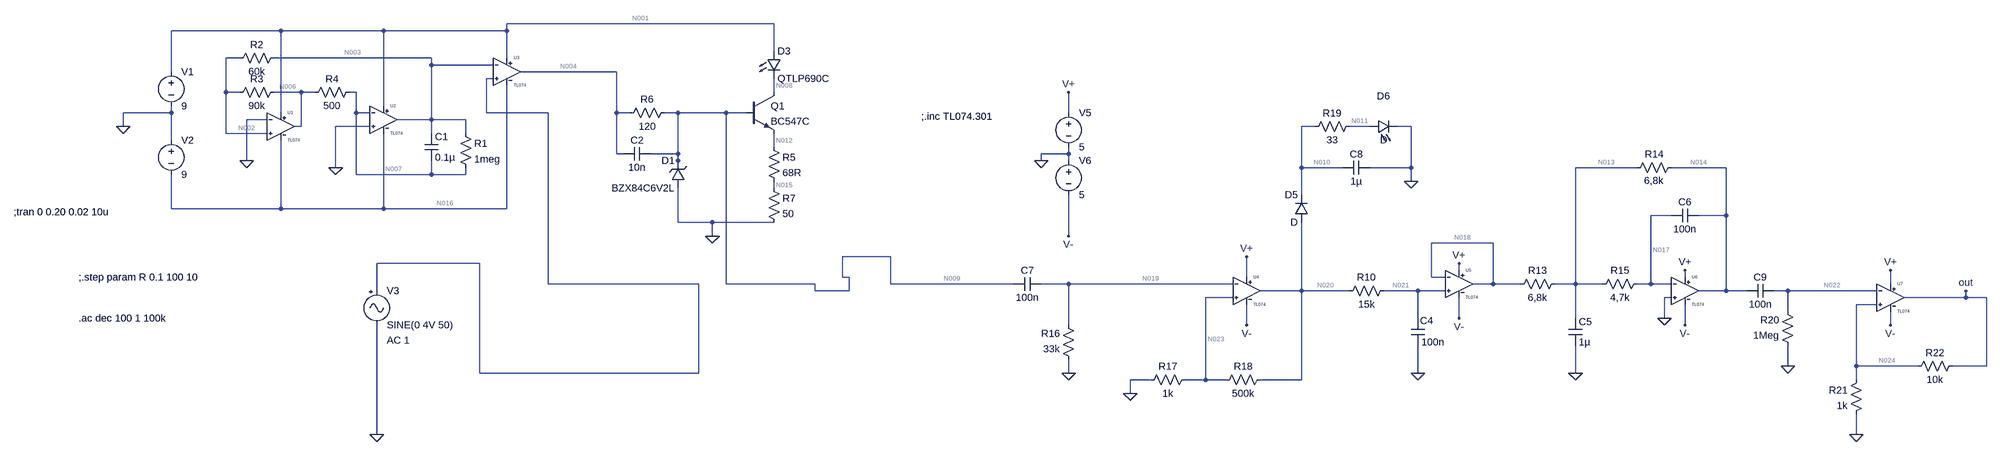
[diagram p0: schematic simTotal.asc]
simTotal.asc, the LTspice schematic file:
Version 4
SHEET 1 4244 964
WIRE 1408 -16 784 -16
WIRE 256 0 0 0
WIRE 496 0 256 0
WIRE 784 0 784 -16
WIRE 784 0 496 0
WIRE 1408 48 1408 -16
WIRE 160 64 128 64
WIRE 608 64 240 64
WIRE 784 64 784 0
WIRE 608 80 608 64
WIRE 752 80 608 80
WIRE 0 96 0 0
WIRE 1040 96 816 96
WIRE 752 112 736 112
WIRE 128 144 128 64
WIRE 160 144 128 144
WIRE 304 144 240 144
WIRE 336 144 304 144
WIRE 432 144 416 144
WIRE 1408 144 1408 112
WIRE 496 176 496 0
WIRE 0 192 0 176
WIRE 0 192 -112 192
WIRE 256 192 256 0
WIRE 432 192 432 144
WIRE 464 192 432 192
WIRE 736 192 736 112
WIRE 880 192 736 192
WIRE 1040 192 1040 96
WIRE 1072 192 1040 192
WIRE 1184 192 1152 192
WIRE 1296 192 1184 192
WIRE 1344 192 1296 192
WIRE 2096 192 2096 144
WIRE 224 208 176 208
WIRE 608 208 608 80
WIRE 608 208 528 208
WIRE 688 208 608 208
WIRE -112 224 -112 192
WIRE 304 224 304 144
WIRE 304 224 288 224
WIRE 464 224 384 224
WIRE 2672 224 2640 224
WIRE 2800 224 2752 224
WIRE 2896 224 2864 224
WIRE 128 240 128 144
WIRE 224 240 128 240
WIRE 608 240 608 208
WIRE 688 240 688 208
WIRE 0 256 0 192
WIRE 1408 272 1408 240
WIRE 1040 288 1040 192
WIRE 1056 288 1040 288
WIRE 1184 288 1184 192
WIRE 1184 288 1120 288
WIRE 2096 288 2096 272
WIRE 2096 288 2032 288
WIRE 176 304 176 208
WIRE 1184 304 1184 288
WIRE 2032 304 2032 288
WIRE 2096 304 2096 288
WIRE 384 320 384 224
WIRE 1184 320 1184 304
WIRE 2640 320 2640 224
WIRE 2736 320 2640 320
WIRE 2896 320 2896 224
WIRE 2896 320 2800 320
WIRE 3424 320 3280 320
WIRE 3632 320 3504 320
WIRE 432 336 432 192
WIRE 608 336 608 304
WIRE 608 336 432 336
WIRE 688 336 688 320
WIRE 688 336 608 336
WIRE 2896 352 2896 320
WIRE 1408 368 1408 352
WIRE 2640 384 2640 320
WIRE 0 416 0 336
WIRE 256 416 256 256
WIRE 256 416 0 416
WIRE 496 416 496 240
WIRE 496 416 256 416
WIRE 784 416 784 128
WIRE 784 416 496 416
WIRE 3504 432 3456 432
WIRE 3632 432 3632 320
WIRE 3632 432 3568 432
WIRE 1184 448 1184 368
WIRE 1264 448 1184 448
WIRE 1408 448 1264 448
WIRE 1264 480 1264 448
WIRE 2096 480 2096 384
WIRE 3088 496 2944 496
WIRE 1680 528 1568 528
WIRE 720 544 480 544
WIRE 3008 560 3008 544
WIRE 1568 576 1568 528
WIRE 1584 576 1568 576
WIRE 2512 576 2512 528
WIRE 2944 576 2944 496
WIRE 2976 576 2944 576
WIRE 3536 576 3536 560
WIRE 880 592 880 192
WIRE 1232 592 880 592
WIRE 1296 592 1296 192
WIRE 1504 592 1296 592
WIRE 1680 592 1680 528
WIRE 1968 592 1680 592
WIRE 2096 592 2032 592
WIRE 2480 592 2096 592
WIRE 3088 592 3088 496
WIRE 3088 592 3040 592
WIRE 3152 592 3088 592
WIRE 3280 592 3280 320
WIRE 3280 592 3232 592
WIRE 3344 592 3280 592
WIRE 3456 592 3456 432
WIRE 3456 592 3424 592
WIRE 3504 592 3456 592
WIRE 4016 592 4016 560
WIRE 480 608 480 544
WIRE 1504 608 1504 592
WIRE 1584 608 1584 576
WIRE 1584 608 1504 608
WIRE 2640 608 2640 448
WIRE 2640 608 2544 608
WIRE 2752 608 2640 608
WIRE 2912 608 2832 608
WIRE 2976 608 2912 608
WIRE 3632 608 3632 432
WIRE 3632 608 3568 608
WIRE 3680 608 3632 608
WIRE 3776 608 3744 608
WIRE 3984 608 3776 608
WIRE 2480 624 2416 624
WIRE 3504 624 3488 624
WIRE 4192 624 4192 608
WIRE 4192 624 4048 624
WIRE 4240 624 4192 624
WIRE 3984 640 3936 640
WIRE 3776 656 3776 608
WIRE 2912 672 2912 608
WIRE 3008 672 3008 624
WIRE 3280 672 3280 592
WIRE 3488 672 3488 624
WIRE 2096 688 2096 592
WIRE 2512 688 2512 640
WIRE 3536 688 3536 640
WIRE 4016 688 4016 656
WIRE 3776 784 3776 736
WIRE 3936 784 3936 640
WIRE 4080 784 3936 784
WIRE 4240 784 4240 624
WIRE 4240 784 4160 784
WIRE 720 800 720 544
WIRE 1232 800 1232 592
WIRE 1232 800 720 800
WIRE 2096 800 2096 768
WIRE 2912 800 2912 736
WIRE 3280 800 3280 736
WIRE 2288 816 2240 816
WIRE 2416 816 2416 624
WIRE 2416 816 2368 816
WIRE 2464 816 2416 816
WIRE 2640 816 2640 608
WIRE 2640 816 2544 816
WIRE 3936 816 3936 784
WIRE 2240 848 2240 816
WIRE 480 944 480 688
WIRE 3936 944 3936 896
FLAG -112 224 0
FLAG 176 304 0
FLAG 384 320 0
FLAG 1264 480 0
FLAG 480 944 0
FLAG 2912 800 0
FLAG 3280 800 0
FLAG 3488 672 0
FLAG 2096 144 V+
FLAG 3008 544 V+
FLAG 3536 560 V+
FLAG 3536 688 V-
FLAG 3008 672 V-
FLAG 2096 480 V-
FLAG 2032 304 0
FLAG 2512 528 V+
FLAG 2512 688 V-
FLAG 2096 800 0
FLAG 2240 848 0
FLAG 2896 352 0
FLAG 3776 784 0
FLAG 4016 560 V+
FLAG 4016 688 V-
FLAG 3936 944 0
FLAG 4192 608 out
SYMBOL voltage 0 80 R0
WINDOW 123 0 0 Left 2
WINDOW 39 0 0 Left 2
SYMATTR InstName V1
SYMATTR Value 9
SYMBOL voltage 0 240 R0
WINDOW 123 0 0 Left 2
WINDOW 39 0 0 Left 2
SYMATTR InstName V2
SYMATTR Value 9
SYMBOL cap 592 240 R0
SYMATTR InstName C1
SYMATTR Value 0.1µ
SYMBOL res 672 224 R0
SYMATTR InstName R1
SYMATTR Value 1meg
SYMBOL res 256 48 R90
WINDOW 0 0 56 VBottom 2
WINDOW 3 32 56 VTop 2
SYMATTR InstName R2
SYMATTR Value 60k
SYMBOL res 256 128 R90
WINDOW 0 0 56 VBottom 2
WINDOW 3 32 56 VTop 2
SYMATTR InstName R3
SYMATTR Value 90k
SYMBOL res 432 128 R90
WINDOW 0 0 56 VBottom 2
WINDOW 3 32 56 VTop 2
SYMATTR InstName R4
SYMATTR Value 500
SYMBOL Misc\\signal 480 592 R0
WINDOW 123 24 132 Left 2
WINDOW 39 0 0 Left 2
SYMATTR Value2 AC 1
SYMATTR InstName V3
SYMATTR Value SINE(0 4V 50)
SYMBOL npn 1344 144 R0
SYMATTR InstName Q1
SYMATTR Value BC547C
SYMBOL res 1168 176 R90
WINDOW 0 0 56 VBottom 2
WINDOW 3 32 56 VTop 2
SYMATTR InstName R6
SYMATTR Value 120
SYMBOL res 1392 352 R0
SYMATTR InstName R7
SYMATTR Value 50
SYMBOL zener 1200 368 R180
WINDOW 0 24 64 Left 2
WINDOW 3 24 0 Left 2
SYMATTR InstName D1
SYMATTR Value BZX84C6V2L
SYMBOL cap 1120 272 R90
WINDOW 0 0 32 VBottom 2
WINDOW 3 32 32 VTop 2
SYMATTR InstName C2
SYMATTR Value 10n
SYMBOL TL074 256 160 R0
SYMATTR InstName U1
SYMBOL TL074 496 144 R0
SYMATTR InstName U2
SYMBOL TL074 784 32 R0
SYMATTR InstName U3
SYMBOL LED 1392 48 R0
SYMATTR InstName D3
SYMATTR Value QTLP690C
SYMBOL res 1392 256 R0
SYMATTR InstName R5
SYMATTR Value 68R
SYMBOL cap 2896 672 R0
WINDOW 0 21 6 Left 2
SYMATTR InstName C4
SYMATTR Value 100n
SYMBOL cap 3264 672 R0
SYMATTR InstName C5
SYMATTR Value 1µ
SYMBOL cap 3568 416 R90
WINDOW 0 0 32 VBottom 2
WINDOW 3 32 32 VTop 2
SYMATTR InstName C6
SYMATTR Value 100n
SYMBOL res 2848 592 R90
WINDOW 0 0 56 VBottom 2
WINDOW 3 32 56 VTop 2
SYMATTR InstName R10
SYMATTR Value 15k
SYMBOL res 3248 576 R90
WINDOW 0 0 56 VBottom 2
WINDOW 3 32 56 VTop 2
SYMATTR InstName R13
SYMATTR Value 6,8k
SYMBOL res 3520 304 R90
WINDOW 0 0 56 VBottom 2
WINDOW 3 31 57 VTop 2
SYMATTR InstName R14
SYMATTR Value 6,8k
SYMBOL res 3440 576 R90
WINDOW 0 0 56 VBottom 2
WINDOW 3 32 56 VTop 2
SYMATTR InstName R15
SYMATTR Value 4,7k
SYMBOL voltage 2096 176 R0
WINDOW 123 0 0 Left 2
WINDOW 39 0 0 Left 2
SYMATTR InstName V5
SYMATTR Value 5
SYMBOL voltage 2096 288 R0
WINDOW 123 0 0 Left 2
WINDOW 39 0 0 Left 2
SYMATTR InstName V6
SYMATTR Value 5
SYMBOL res 2112 784 R180
WINDOW 0 36 76 Left 2
WINDOW 3 36 40 Left 2
SYMATTR InstName R16
SYMATTR Value 33k
SYMBOL cap 2032 576 R90
WINDOW 0 0 32 VBottom 2
WINDOW 3 32 32 VTop 2
SYMATTR InstName C7
SYMATTR Value 100n
SYMBOL res 2384 800 R90
WINDOW 0 0 56 VBottom 2
WINDOW 3 32 56 VTop 2
SYMATTR InstName R17
SYMATTR Value 1k
SYMBOL res 2560 800 R90
WINDOW 0 0 56 VBottom 2
WINDOW 3 32 56 VTop 2
SYMATTR InstName R18
SYMATTR Value 500k
SYMBOL diode 2656 448 R180
WINDOW 0 24 64 Left 2
WINDOW 3 24 0 Left 2
SYMATTR InstName D5
SYMBOL LED 2800 240 R270
WINDOW 0 72 32 VTop 2
WINDOW 3 0 32 VBottom 2
SYMATTR InstName D6
SYMBOL res 2768 208 R90
WINDOW 0 0 56 VBottom 2
WINDOW 3 32 56 VTop 2
SYMATTR InstName R19
SYMATTR Value 33
SYMBOL cap 2800 304 R90
WINDOW 0 0 32 VBottom 2
WINDOW 3 32 32 VTop 2
SYMATTR InstName C8
SYMATTR Value 1µ
SYMBOL cap 3744 592 R90
WINDOW 0 0 32 VBottom 2
WINDOW 3 32 32 VTop 2
SYMATTR InstName C9
SYMATTR Value 100n
SYMBOL res 3792 752 R180
WINDOW 0 36 76 Left 2
WINDOW 3 36 40 Left 2
SYMATTR InstName R20
SYMATTR Value 1Meg
SYMBOL res 3952 800 M0
SYMATTR InstName R21
SYMATTR Value 1k
SYMBOL res 4064 800 R270
WINDOW 0 32 56 VTop 2
WINDOW 3 0 56 VBottom 2
SYMATTR InstName R22
SYMATTR Value 10k
SYMBOL TL074 2512 544 R0
SYMATTR InstName U4
SYMBOL TL074 3008 528 R0
SYMATTR InstName U5
SYMBOL TL074 3536 544 R0
SYMATTR InstName U6
SYMBOL TL074 4016 560 R0
SYMATTR InstName U7
TEXT -368 424 Left 2 !;tran 0 0.20 0.02 10u
TEXT -216 576 Left 2 !;.step param R 0.1 100 10
TEXT 1752 200 Left 2 !;.inc TL074.301
TEXT -216 672 Left 2 !.ac dec 100 1 100k

The netlist it stands for:
* simTotal.asc
V1 N001 0 9
V2 0 N016 9
C1 N003 N007 0.1µ
R1 N003 N007 1meg
R2 N003 N002 60k
R3 N006 N002 90k
R4 N007 N006 500
V3 N005 0 SINE(0 4V 50) AC 1
Q1 N008 N009 N012 0 BC547C
R6 N009 N004 120
R7 N015 0 50
D1 0 N009 BZX84C6V2L
C2 N009 N004 10n
XU1 N002 0 N001 N016 N006 TL074  ; pins In+ In- V+ V- OUT
XU2 0 N007 N001 N016 N003 TL074  ; pins In+ In- V+ V- OUT
XU3 N005 N003 N001 N016 N004 TL074  ; pins In+ In- V+ V- OUT
D3 N001 N008 QTLP690C
R5 N012 N015 68R
C4 N021 0 100n
C5 N013 0 1µ
C6 N014 N017 100n
R10 N021 N020 15k
R13 N013 N018 6,8k
R14 N014 N013 6,8k
R15 N017 N013 4,7k
V5 V+ 0 5
V6 0 V- 5
R16 0 N019 33k
C7 N019 N009 100n
R17 N023 0 1k
R18 N020 N023 500k
D5 N020 N010 D
D6 N011 0 D
R19 N011 N010 33
C8 0 N010 1µ
C9 N022 N014 100n
R20 0 N022 1Meg
R21 N024 0 1k
R22 N024 out 10k
XU4 N023 N019 V+ V- N020 TL074  ; pins In+ In- V+ V- OUT
XU5 N021 N018 V+ V- N018 TL074  ; pins In+ In- V+ V- OUT
XU6 0 N017 V+ V- N014 TL074  ; pins In+ In- V+ V- OUT
XU7 N024 N022 V+ V- out TL074  ; pins In+ In- V+ V- OUT
.model D D
.lib standard.dio
.model NPN NPN
.model PNP PNP
.lib standard.bjt
;tran 0 0.20 0.02 10u
;.step param R 0.1 100 10
;.inc TL074.301
.ac dec 100 1 100k
.lib OWN.lib
.backanno
.end

* Results of the author's LTspice run, read from the files saved beside the schematic
* Operating Point, zero values left out:
*   V(n001) = 9 V
*   V(n016) = -9 V
*   V(n003) = -23.28 µV
*   V(n007) = 10.97 µV
*   V(n002) = -10.97 µV
*   V(n006) = 11.01 µV
*   V(n008) = 6.871 V
*   V(n009) = 6.3 V
*   V(n012) = 5.559 V
*   V(n004) = 6.744 V
*   V(n015) = 2.355 V
*   V(n021) = 2.321 V
*   V(n013) = 21.71 µV
*   V(n014) = -2.321 V
*   V(n017) = 21.47 µV
*   V(n020) = 2.321 V
*   V(n018) = 2.321 V
*   V(v+) = 5 V
*   V(v-) = -5 V
*   V(n019) = -1.157 µV
*   V(n023) = 4.632 mV
*   V(n010) = 1.582 V
*   V(n011) = 738.9 mV
*   V(n022) = -34.74 µV
*   V(n024) = 314.5 mV
*   V(out) = 3.459 V
*   Ic(Q1) = 46.97 mA
*   Ib(Q1) = 136.3 µA
*   Ie(Q1) = -47.11 mA
*   I(D6) = 25.55 mA
*   I(D5) = 25.55 mA
*   I(D3) = 46.97 mA
*   I(D1) = -3.563 mA
*   I(R22) = -314.5 µA
*   I(R21) = 314.5 µA
*   I(R20) = 34.74 pA
*   I(R19) = -25.55 mA
*   I(R18) = 4.633 µA
*   I(R17) = 4.632 µA
*   I(R16) = 35.05 pA
*   I(R15) = -35.05 pA
*   I(R14) = -290.1 µA
*   I(R13) = -290.1 µA
*   I(R10) = -37.38 pA
*   I(R5) = 47.11 mA
*   I(R7) = 47.11 mA
*   I(R6) = -3.7 mA
*   I(R4) = -73.3 pA
*   I(R3) = 244.2 pA
*   I(R2) = -205.2 pA
*   I(R1) = -34.25 pA
*   I(V6) = -19.44 mA
*   I(V5) = -19.35 mA
*   I(V3) = -39.05 pA
*   I(V2) = -25.78 mA
*   I(V1) = -72.75 mA
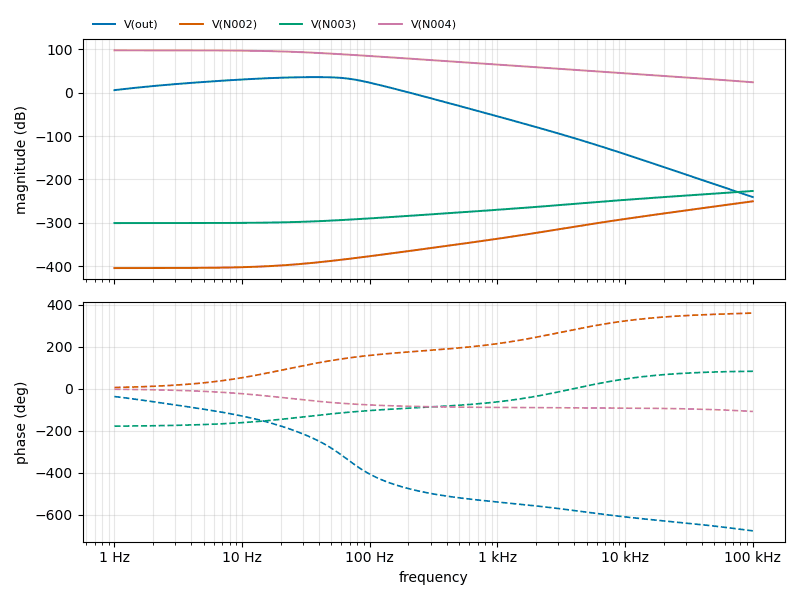
[diagram p1: AC Analysis of simTotal.asc, plotted from the saved traces]
* AC Analysis, 1 run:
*   V(out): 5.66 dB at 1 Hz, -240.52 dB at 100 kHz, peak 35.65 dB at 37.15 Hz, 3 dB below the peak at 14.55 Hz and 65.77 Hz
*   V(N002): -404.18 dB at 1 Hz, -250.35 dB at 100 kHz, peak -250.35 dB at 100 kHz, 3 dB below the peak at 84.05 kHz
*   V(N003): -300.54 dB at 1 Hz, -226.60 dB at 100 kHz, peak -226.60 dB at 100 kHz, 3 dB below the peak at 70.79 kHz
*   V(N004): 97.33 dB at 1 Hz, 23.77 dB at 100 kHz, peak 97.33 dB at 1 Hz, 3 dB below the peak at 22.83 Hz